# Altium schematic sheet FLOLED-BASE.SchDoc
size 203 x 127 mm; SheetNumber: 1; SheetTotal: 1
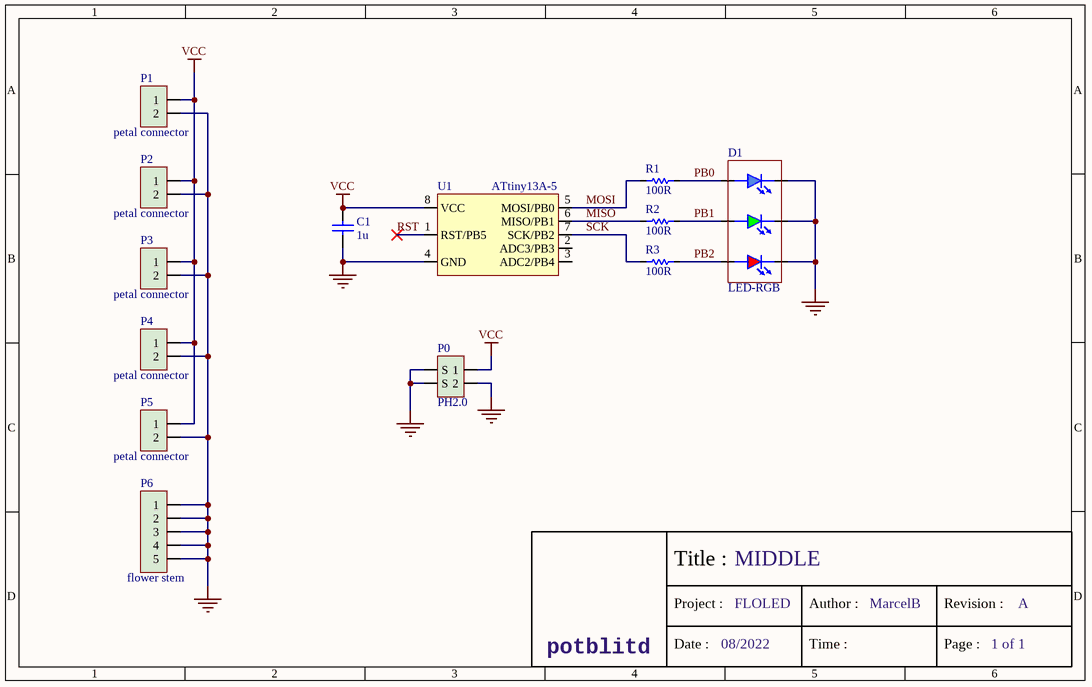
[diagram p0: FLOLED-BASE.SchDoc]

## Parts
C1  value 1u  [0603C]  (hidden comment: Capacitor)
D1  LED-RGB  [5050-RGB]
P0  PH2.0  [2.0-2P LT]
P1  petal connector  [FLOWER PETAL CONNECTORS]
P2  petal connector  [FLOWER PETAL CONNECTORS]
P3  petal connector  [FLOWER PETAL CONNECTORS]
P4  petal connector  [FLOWER PETAL CONNECTORS]
P5  petal connector  [FLOWER PETAL CONNECTORS]
P6  flower stem  [FLOWER STEM]
R1  value 100R  [0805R]  (hidden comment: Resistor)
R2  value 100R  [0805R]  (hidden comment: Resistor)
R3  value 100R  [0805R]  (hidden comment: Resistor)
U1  ATtiny13A-5  [DIP-8 - SMD]

## Nets
GND: C1.1 D1.2 D1.4 D1.6 P0.2 P0.3(S) P0.4(S) P1.2 P2.2 P3.2 P4.2 P5.2 P6.1 P6.2 P6.3 P6.4 P6.5 U1.4(GND)
VCC: C1.2 P0.1 P1.1 P2.1 P3.1 P4.1 P5.1 U1.8(VCC)
MISO: R2.1 U1.6(MISO/PB1)
MOSI: R1.1 U1.5(MOSI/PB0)
PB0: D1.5 R1.2
PB1: D1.3 R2.2
PB2: D1.1 R3.2
RST: U1.1(RST/PB5)
SCK: R3.1 U1.7(SCK/PB2)

Not connected (* = marked no-connect by the designer): U1 2(ADC3/PB3) 3(ADC2/PB4)

## Notes on the sheet
- Title :
- MIDDLE
- Project :
- FLOLED
- Author :
- MarcelB
- Revision :
- A
- potblitd
- Date :
- 08/2022
- Time :
- Page :
- 1 of 1

## Library data of the parts
C1 = Capacitor: Capacitor 1uF; Value: 1uF
P0 = PH2.0-2P-SMT: PH2.0 SMD connector
P1-P5 = 2-pins Header: Holes for flower petal PCB
P6 = 5-pins Header: Holes for flower stem rods
R1-R3 = RES: Resistor 100Ω
U1 = ATtiny13A-5: tiny AVR 8-pin microcontroller; Value: 13A